# EAGLE design TiLDA Mk2 ProtoShield v0.1 (EAGLE 7.1.0)
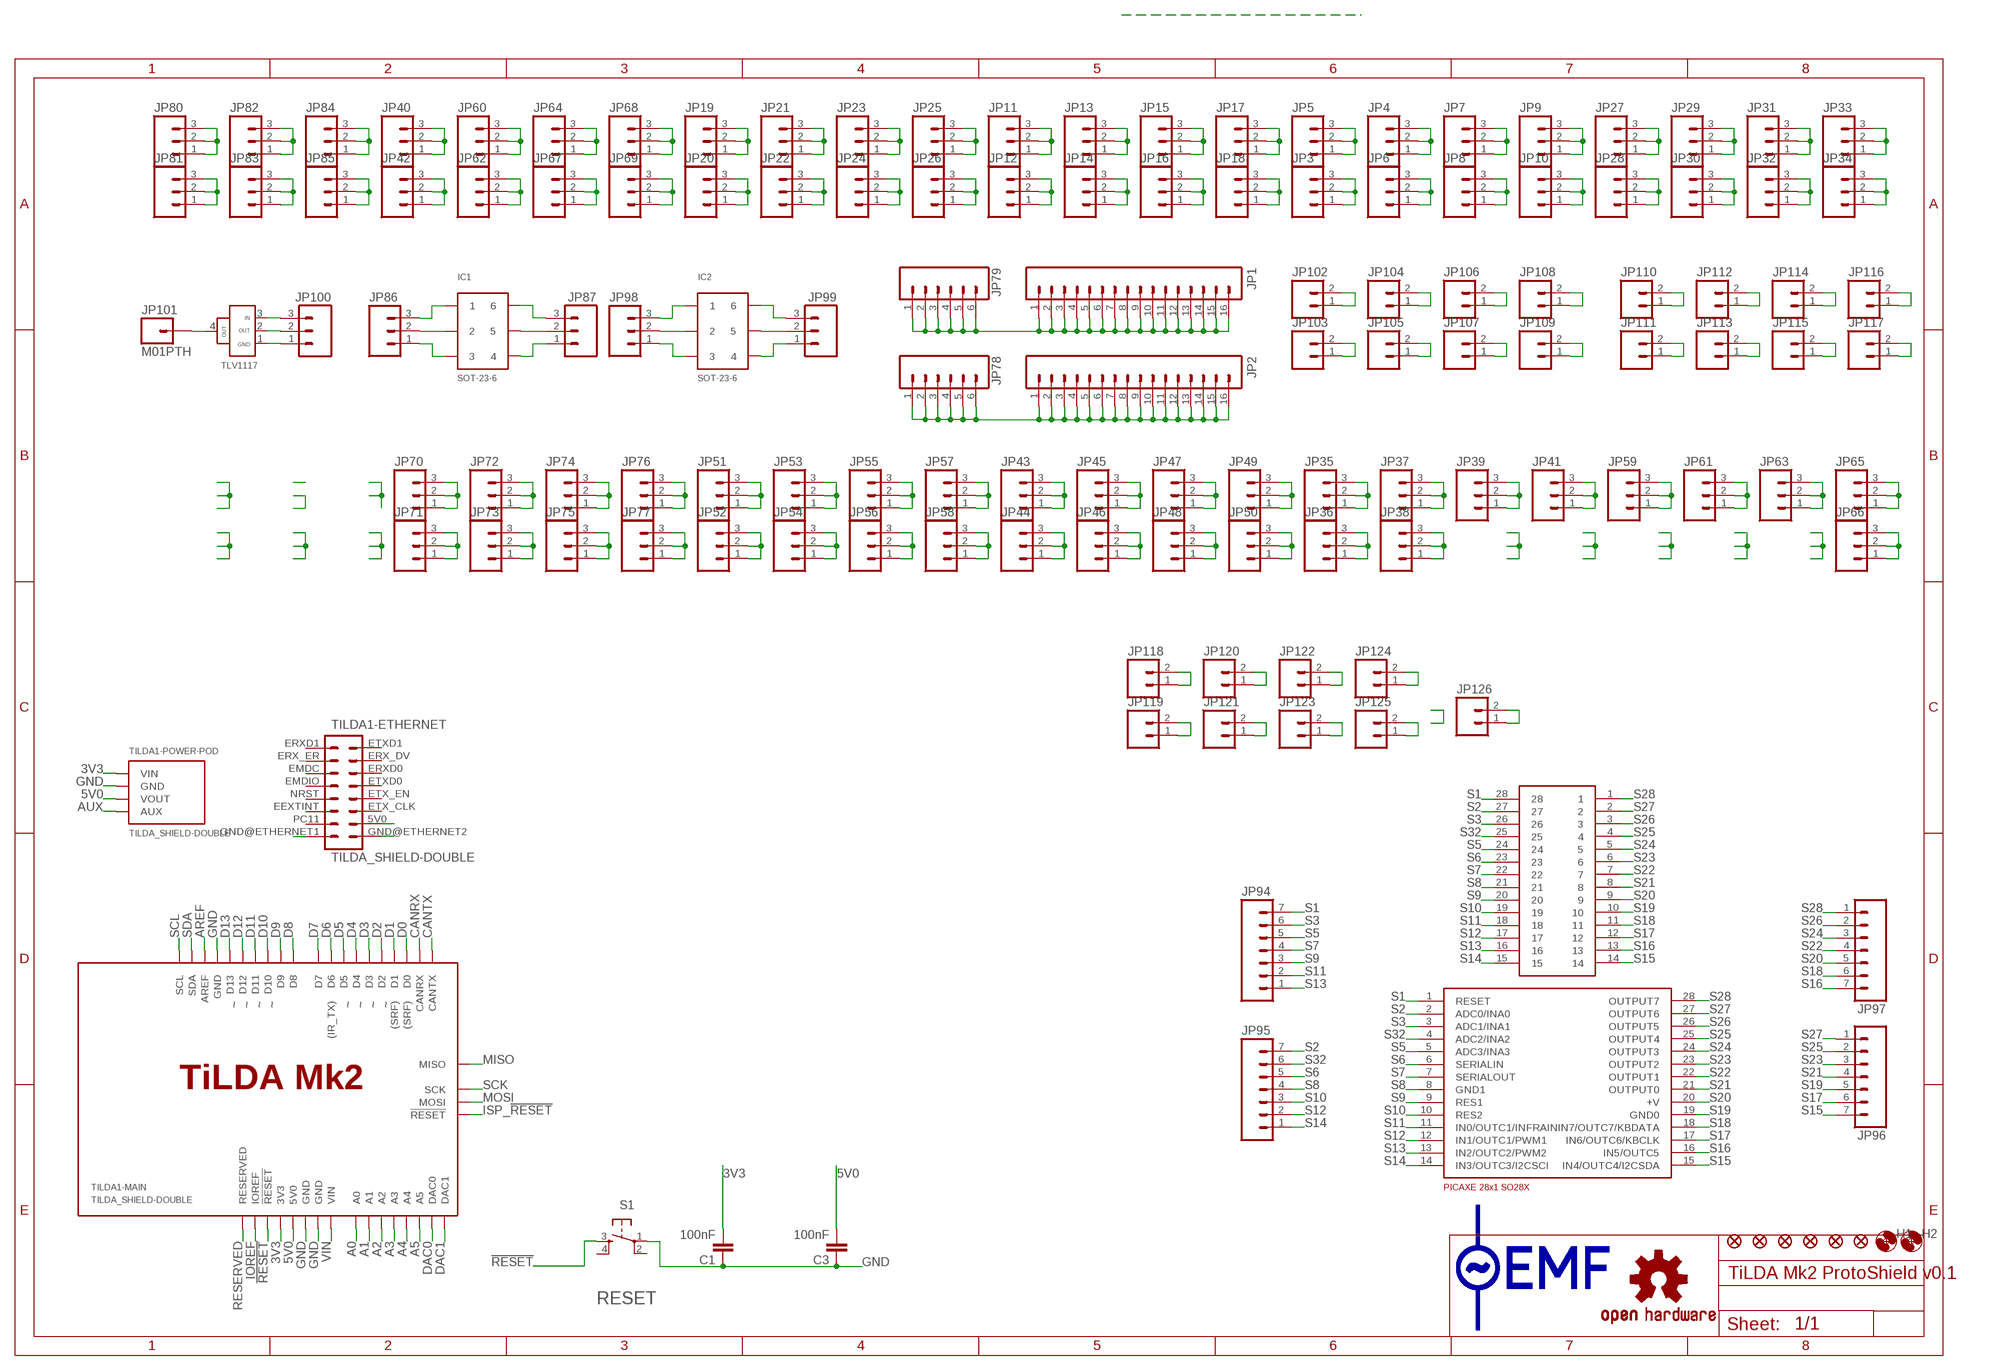
[diagram p0: schematic, sheet 1]

## Parts
C1  100nF  C-EU025-024X044  [C025-024X044]
C3  100nF  C-EU025-024X044  [C025-024X044]
FID1  FIDUCIAL1X2.5-STOP  [FIDUCIAL-1X2.5-STOP]
FID2  FIDUCIAL1X2.5-STOP  [FIDUCIAL-1X2.5-STOP]
FID3  FIDUCIAL1X2.5-STOP  [FIDUCIAL-1X2.5-STOP]
FID4  FIDUCIAL1X2.5-STOP  [FIDUCIAL-1X2.5-STOP]
FID5  FIDUCIAL1X2.5-STOP  [FIDUCIAL-1X2.5-STOP]
FID6  FIDUCIAL1X2.5-STOP  [FIDUCIAL-1X2.5-STOP]
H1  MOUNT-HOLE4.5-LWK  [4,5-LWK]
H2  MOUNT-HOLE4.5-LWK  [4,5-LWK]
IC1  SOT-23-6  [SOT-23-6]
IC2  SOT-23-6  [SOT-23-6]
JP1  M16PROTO_SILK  [1X16_PROTO_SILK]
JP2  M16PROTO_SILK  [1X16_PROTO_SILK]
JP3  M03PROTO_SILK  [1X03_PROTO_SILK]
JP4  M03PROTO_SILK  [1X03_PROTO_SILK]
JP5  M03PROTO_SILK  [1X03_PROTO_SILK]
JP6  M03PROTO_SILK  [1X03_PROTO_SILK]
JP7  M03PROTO_SILK  [1X03_PROTO_SILK]
JP8  M03PROTO_SILK  [1X03_PROTO_SILK]
JP9  M03PROTO_SILK  [1X03_PROTO_SILK]
JP10  M03PROTO_SILK  [1X03_PROTO_SILK]
JP11  M03PROTO_SILK  [1X03_PROTO_SILK]
JP12  M03PROTO_SILK  [1X03_PROTO_SILK]
JP13  M03PROTO_SILK  [1X03_PROTO_SILK]
JP14  M03PROTO_SILK  [1X03_PROTO_SILK]
JP15  M03PROTO_SILK  [1X03_PROTO_SILK]
JP16  M03PROTO_SILK  [1X03_PROTO_SILK]
JP17  M03PROTO_SILK  [1X03_PROTO_SILK]
JP18  M03PROTO_SILK  [1X03_PROTO_SILK]
JP19  M03PROTO_SILK  [1X03_PROTO_SILK]
JP20  M03PROTO_SILK  [1X03_PROTO_SILK]
JP21  M03PROTO_SILK  [1X03_PROTO_SILK]
JP22  M03PROTO_SILK  [1X03_PROTO_SILK]
JP23  M03PROTO_SILK  [1X03_PROTO_SILK]
JP24  M03PROTO_SILK  [1X03_PROTO_SILK]
JP25  M03PROTO_SILK  [1X03_PROTO_SILK]
JP26  M03PROTO_SILK  [1X03_PROTO_SILK]
JP27  M03PROTO_SILK  [1X03_PROTO_SILK]
JP28  M03PROTO_SILK  [1X03_PROTO_SILK]
JP29  M03PROTO_SILK  [1X03_PROTO_SILK]
JP30  M03PROTO_SILK  [1X03_PROTO_SILK]
JP31  M03PROTO_SILK  [1X03_PROTO_SILK]
JP32  M03PROTO_SILK  [1X03_PROTO_SILK]
JP33  M03PROTO_SILK  [1X03_PROTO_SILK]
JP34  M03PROTO_SILK  [1X03_PROTO_SILK]
JP35  M03PROTO_SILK  [1X03_PROTO_SILK]
JP36  M03PROTO_SILK  [1X03_PROTO_SILK]
JP37  M03PROTO_SILK  [1X03_PROTO_SILK]
JP38  M03PROTO_SILK  [1X03_PROTO_SILK]
JP39  M03PROTO_SILK  [1X03_PROTO_SILK]
JP40  M03PROTO_SILK  [1X03_PROTO_SILK]
JP41  M03PROTO_SILK  [1X03_PROTO_SILK]
JP42  M03PROTO_SILK  [1X03_PROTO_SILK]
JP43  M03PROTO_SILK  [1X03_PROTO_SILK]
JP44  M03PROTO_SILK  [1X03_PROTO_SILK]
JP45  M03PROTO_SILK  [1X03_PROTO_SILK]
JP46  M03PROTO_SILK  [1X03_PROTO_SILK]
JP47  M03PROTO_SILK  [1X03_PROTO_SILK]
JP48  M03PROTO_SILK  [1X03_PROTO_SILK]
JP49  M03PROTO_SILK  [1X03_PROTO_SILK]
JP50  M03PROTO_SILK  [1X03_PROTO_SILK]
JP51  M03PROTO_SILK  [1X03_PROTO_SILK]
JP52  M03PROTO_SILK  [1X03_PROTO_SILK]
JP53  M03PROTO_SILK  [1X03_PROTO_SILK]
JP54  M03PROTO_SILK  [1X03_PROTO_SILK]
JP55  M03PROTO_SILK  [1X03_PROTO_SILK]
JP56  M03PROTO_SILK  [1X03_PROTO_SILK]
JP57  M03PROTO_SILK  [1X03_PROTO_SILK]
JP58  M03PROTO_SILK  [1X03_PROTO_SILK]
JP59  M03PROTO_SILK  [1X03_PROTO_SILK]
JP60  M03PROTO_SILK  [1X03_PROTO_SILK]
JP61  M03PROTO_SILK  [1X03_PROTO_SILK]
JP62  M03PROTO_SILK  [1X03_PROTO_SILK]
JP63  M03PROTO_SILK  [1X03_PROTO_SILK]
JP64  M03PROTO_SILK  [1X03_PROTO_SILK]
JP65  M03PROTO_SILK  [1X03_PROTO_SILK]
JP66  M03PROTO_SILK  [1X03_PROTO_SILK]
JP67  M03PROTO_SILK  [1X03_PROTO_SILK]
JP68  M03PROTO_SILK  [1X03_PROTO_SILK]
JP69  M03PROTO_SILK  [1X03_PROTO_SILK]
JP70  M03PROTO_SILK  [1X03_PROTO_SILK]
JP71  M03PROTO_SILK  [1X03_PROTO_SILK]
JP72  M03PROTO_SILK  [1X03_PROTO_SILK]
JP73  M03PROTO_SILK  [1X03_PROTO_SILK]
JP74  M03PROTO_SILK  [1X03_PROTO_SILK]
JP75  M03PROTO_SILK  [1X03_PROTO_SILK]
JP76  M03PROTO_SILK  [1X03_PROTO_SILK]
JP77  M03PROTO_SILK  [1X03_PROTO_SILK]
JP78  M06PROTO_SILK  [1X06_PROTO_SLIK]
JP79  M06PROTO_SILK  [1X06_PROTO_SLIK]
JP80  M03PROTO_SILK  [1X03_PROTO_SILK]
JP81  M03PROTO_SILK  [1X03_PROTO_SILK]
JP82  M03PROTO_SILK  [1X03_PROTO_SILK]
JP83  M03PROTO_SILK  [1X03_PROTO_SILK]
JP84  M03PROTO_SILK  [1X03_PROTO_SILK]
JP85  M03PROTO_SILK  [1X03_PROTO_SILK]
JP86  M03PTH  [1X03]
JP87  M03PTH  [1X03]
JP94  M07  [1X07]
JP95  M07  [1X07]
JP96  M07  [1X07]
JP97  M07  [1X07]
JP98  M03PTH  [1X03]
JP99  M03PTH  [1X03]
JP100  M03PTH  [1X03]
JP101  M01PTH  [1X01]
JP102  M02PROTO_SILK  [1X02_PROTO_SILK]
JP103  M02PROTO_SILK  [1X02_PROTO_SILK]
JP104  M02PROTO_SILK  [1X02_PROTO_SILK]
JP105  M02PROTO_SILK  [1X02_PROTO_SILK]
JP106  M02PROTO_SILK  [1X02_PROTO_SILK]
JP107  M02PROTO_SILK  [1X02_PROTO_SILK]
JP108  M02PROTO_SILK  [1X02_PROTO_SILK]
JP109  M02PROTO_SILK  [1X02_PROTO_SILK]
JP110  M02PROTO_SILK  [1X02_PROTO_SILK]
JP111  M02PROTO_SILK  [1X02_PROTO_SILK]
JP112  M02PROTO_SILK  [1X02_PROTO_SILK]
JP113  M02PROTO_SILK  [1X02_PROTO_SILK]
JP114  M02PROTO_SILK  [1X02_PROTO_SILK]
JP115  M02PROTO_SILK  [1X02_PROTO_SILK]
JP116  M02PROTO_SILK  [1X02_PROTO_SILK]
JP117  M02PROTO_SILK  [1X02_PROTO_SILK]
JP118  M02PROTO_SILK  [1X02_PROTO_SILK]
JP119  M02PROTO_SILK  [1X02_PROTO_SILK]
JP120  M02PROTO_SILK  [1X02_PROTO_SILK]
JP121  M02PROTO_SILK  [1X02_PROTO_SILK]
JP122  M02PROTO_SILK  [1X02_PROTO_SILK]
JP123  M02PROTO_SILK  [1X02_PROTO_SILK]
JP124  M02PROTO_SILK  [1X02_PROTO_SILK]
JP125  M02PROTO_SILK  [1X02_PROTO_SILK]
JP126  M02PROTO_SILK  [1X02_PROTO_SILK]
LOGO1  OSHW-LOGOM  [OSHW-LOGO-M]
LOGO2  EMFLOGO-2014-BOTH  [EMFLOGO4]
S1  TAC_SWITCHPTH  [TACTILE-PTH]
TILDA1  TILDA_SHIELD-DOUBLE  [TILDA_SHIELD_DOUBLE]
U$1  TLV1117-33CDCY  [SOT223]
U$2  SSOP28-NOSLIK  [SSOP28D-NOSILK]
U$5  PICAXE-28X1-SO28-MULITWIDE  [S028-MUTLIWIDE]

## Nets
3V3: C1.2 TILDA1.3V3@1(-MAIN:3V3) TILDA1.3V3@2(-MAIN:3V3) TILDA1.3V3@POD1(-POWER-POD:VIN) TILDA1.3V3@POD(-POWER-POD:VIN)
5V0: C3.2 TILDA1.5V0 TILDA1.5V0@1(-MAIN:5V0) TILDA1.5V0@POD1(-POWER-POD:VOUT) TILDA1.5V0@POD(-POWER-POD:VOUT) TILDA1.5V(-MAIN:5V0) TILDA1.5V@ISP(-MAIN:5V0) TILDA1.5V@ISP@1(-MAIN:5V0)
!RESET: S1.3 TILDA1.!RESET(-MAIN:!RESET) TILDA1.!RESET@1(-MAIN:!RESET)
A0: TILDA1.A0(-MAIN:A0) TILDA1.A0@1(-MAIN:A0)
A1: TILDA1.A1(-MAIN:A1) TILDA1.A1@1(-MAIN:A1)
A2: TILDA1.A2(-MAIN:A2) TILDA1.A2@1(-MAIN:A2)
A3: TILDA1.A3(-MAIN:A3) TILDA1.A3@1(-MAIN:A3)
A4: TILDA1.A4(-MAIN:A4) TILDA1.A4@1(-MAIN:A4)
A5: TILDA1.A5(-MAIN:A5) TILDA1.A5@1(-MAIN:A5)
AREF: TILDA1.AREF(-MAIN:AREF) TILDA1.AREF@1(-MAIN:AREF)
AUX: TILDA1.AUX@POD1(-POWER-POD:AUX) TILDA1.AUX@POD(-POWER-POD:AUX)
CANRX: TILDA1.CANRX(-MAIN:CANRX) TILDA1.CANRX@1(-MAIN:CANRX)
CANTX: TILDA1.CANTX(-MAIN:CANTX) TILDA1.CANTX@1(-MAIN:CANTX)
D0: TILDA1.D0(-MAIN:D0) TILDA1.D0@1(-MAIN:D0)
D1: TILDA1.D1(-MAIN:D1) TILDA1.D1@1(-MAIN:D1)
D2: TILDA1.D2(-MAIN:D2) TILDA1.D2@1(-MAIN:D2)
D3: TILDA1.D3(-MAIN:D3) TILDA1.D3@1(-MAIN:D3)
D4: TILDA1.D4(-MAIN:D4) TILDA1.D4@1(-MAIN:D4)
D5: TILDA1.D5(-MAIN:D5) TILDA1.D5@1(-MAIN:D5)
D6: TILDA1.D6(-MAIN:D6) TILDA1.D6@1(-MAIN:D6)
D7: TILDA1.D7(-MAIN:D7) TILDA1.D7@1(-MAIN:D7)
D8: TILDA1.D8(-MAIN:D8) TILDA1.D8@1(-MAIN:D8)
D9: TILDA1.D9(-MAIN:D9) TILDA1.D9@1(-MAIN:D9)
D10: TILDA1.D10(-MAIN:D10) TILDA1.D10@1(-MAIN:D10)
D11: TILDA1.D11(-MAIN:D11) TILDA1.D11@1(-MAIN:D11)
D12: TILDA1.D12(-MAIN:D12) TILDA1.D12@1(-MAIN:D12)
D13: TILDA1.D13(-MAIN:D13) TILDA1.D13@1(-MAIN:D13)
DAC0: TILDA1.DAC0(-MAIN:DAC0) TILDA1.DAC0@1(-MAIN:DAC0)
DAC1: TILDA1.DAC1(-MAIN:DAC1) TILDA1.DAC1@1(-MAIN:DAC1)
GND: C1.1 C3.1 S1.1 TILDA1.GND@1(-MAIN:GND) TILDA1.GND@2(-MAIN:GND) TILDA1.GND@3(-MAIN:GND) TILDA1.GND@4(-MAIN:GND) TILDA1.GND@5(-MAIN:GND) TILDA1.GND@6(-MAIN:GND) TILDA1.GND@ETHERNET1 TILDA1.GND@ETHERNET2 TILDA1.GND@ISP1(-MAIN:GND) TILDA1.GND@ISP(-MAIN:GND) TILDA1.GND@POD1(-POWER-POD:GND) TILDA1.GND@POD(-POWER-POD:GND)
IOREF: TILDA1.IOREF(-MAIN:IOREF) TILDA1.IOREF@1(-MAIN:IOREF)
ISP_!RESET: TILDA1.!RESET@ISP1(-MAIN:!RESET) TILDA1.!RESET@ISP(-MAIN:!RESET)
MISO: TILDA1.MISO(-MAIN:MISO) TILDA1.MISO@1(-MAIN:MISO)
MOSI: TILDA1.MOSI(-MAIN:MOSI) TILDA1.MOSI@1(-MAIN:MOSI)
N$1: JP1.1 JP1.2 JP1.3 JP1.4 JP1.5 JP1.6 JP1.7 JP1.8 JP1.9 JP1.10 JP1.11 JP1.12 JP1.13 JP1.14 JP1.15 JP1.16 JP79.1 JP79.2 JP79.3 JP79.4 JP79.5 JP79.6
N$2: JP2.1 JP2.2 JP2.3 JP2.4 JP2.5 JP2.6 JP2.7 JP2.8 JP2.9 JP2.10 JP2.11 JP2.12 JP2.13 JP2.14 JP2.15 JP2.16 JP78.1 JP78.2 JP78.3 JP78.4 JP78.5 JP78.6
N$3: JP5.1 JP5.2 JP5.3
N$4: JP3.1 JP3.2 JP3.3
N$5: JP4.1 JP4.2 JP4.3
N$6: JP6.1 JP6.2 JP6.3
N$7: JP7.1 JP7.2 JP7.3
N$8: JP8.1 JP8.2 JP8.3
N$9: JP9.1 JP9.2 JP9.3
N$10: JP10.1 JP10.2 JP10.3
N$11: JP11.1 JP11.2 JP11.3
N$12: JP12.1 JP12.2 JP12.3
N$13: JP13.1 JP13.2 JP13.3
N$14: JP14.1 JP14.2 JP14.3
N$15: JP15.1 JP15.2 JP15.3
N$16: JP16.1 JP16.2 JP16.3
N$17: JP17.1 JP17.2 JP17.3
N$18: JP18.1 JP18.2 JP18.3
N$19: JP19.1 JP19.2 JP19.3
N$20: JP20.1 JP20.2 JP20.3
N$21: JP21.1 JP21.2 JP21.3
N$22: JP22.1 JP22.2 JP22.3
N$23: JP23.1 JP23.2 JP23.3
N$24: JP24.1 JP24.2 JP24.3
N$25: JP25.1 JP25.2 JP25.3
N$26: JP26.1 JP26.2 JP26.3
N$27: JP27.1 JP27.2 JP27.3
N$28: JP28.1 JP28.2 JP28.3
N$29: JP29.1 JP29.2 JP29.3
N$30: JP30.1 JP30.2 JP30.3
N$31: JP31.1 JP31.2 JP31.3
N$32: JP32.1 JP32.2 JP32.3
N$33: JP33.1 JP33.2 JP33.3
N$34: JP34.1 JP34.2 JP34.3
N$35: JP35.1 JP35.2 JP35.3
N$36: JP36.1 JP36.2 JP36.3
N$37: JP37.1 JP37.2 JP37.3
N$38: JP38.1 JP38.2 JP38.3
N$39: JP39.1 JP39.2 JP39.3
N$41: JP41.1 JP41.2 JP41.3
N$43: JP43.1 JP43.2 JP43.3
N$44: JP44.1 JP44.2 JP44.3
N$45: JP45.1 JP45.2 JP45.3
N$46: JP46.1 JP46.2 JP46.3
N$47: JP47.1 JP47.2 JP47.3
N$48: JP48.1 JP48.2 JP48.3
N$49: JP49.1 JP49.2 JP49.3
N$50: JP50.1 JP50.2 JP50.3
N$51: JP51.1 JP51.2 JP51.3
N$52: JP52.1 JP52.2 JP52.3
N$53: JP53.1 JP53.2 JP53.3
N$54: JP54.1 JP54.2 JP54.3
N$55: JP55.1 JP55.2 JP55.3
N$56: JP56.1 JP56.2 JP56.3
N$57: JP57.1 JP57.2 JP57.3
N$58: JP58.1 JP58.2 JP58.3
N$59: JP59.1 JP59.2 JP59.3
N$61: JP61.1 JP61.2 JP61.3
N$63: JP63.1 JP63.2 JP63.3
N$65: JP65.1 JP65.2 JP65.3
N$66: JP66.1 JP66.2 JP66.3
N$67: JP40.1 JP40.2 JP40.3
N$68: JP42.1 JP42.2 JP42.3
N$69: JP60.1 JP60.2 JP60.3
N$70: JP62.1 JP62.2 JP62.3
N$71: JP64.1 JP64.2 JP64.3
N$72: JP67.1 JP67.2 JP67.3
N$73: JP68.1 JP68.2 JP68.3
N$74: JP69.1 JP69.2 JP69.3
N$75: JP70.1 JP70.2 JP70.3
N$76: JP71.1 JP71.2 JP71.3
N$77: JP72.1 JP72.2 JP72.3
N$78: JP73.1 JP73.2 JP73.3
N$79: JP74.1 JP74.2 JP74.3
N$80: JP75.1 JP75.2 JP75.3
N$81: JP76.1 JP76.2 JP76.3
N$82: JP77.1 JP77.2 JP77.3
N$83: IC1.2 JP86.2
N$84: IC1.1 JP86.3
N$85: JP80.1 JP80.2 JP80.3
N$86: JP81.1 JP81.2 JP81.3
N$87: JP82.1 JP82.2 JP82.3
N$88: JP83.1 JP83.2 JP83.3
N$89: JP84.1 JP84.2 JP84.3
N$90: JP85.1 JP85.2 JP85.3
N$91: IC1.3 JP86.1
N$92: IC1.5 JP87.2
N$99: IC1.6 JP87.3
N$100: IC1.4 JP87.1
N$101: IC2.2 JP98.2
N$102: IC2.1 JP98.3
N$103: IC2.3 JP98.1
N$104: IC2.5 JP99.2
N$105: IC2.6 JP99.3
N$106: IC2.4 JP99.1
N$107: JP100.1 U$1.1(GND)
N$108: JP100.2 U$1.2(OUT1)
N$109: JP100.3 U$1.3(IN)
N$110: JP101.1 U$1.4(OUT2)
N$111: JP102.1 JP102.2
N$112: JP103.1 JP103.2
N$113: JP104.1 JP104.2
N$114: JP105.1 JP105.2
N$115: JP106.1 JP106.2
N$116: JP107.1 JP107.2
N$117: JP108.1 JP108.2
N$118: JP109.1 JP109.2
N$119: JP110.1 JP110.2
N$120: JP111.1 JP111.2
N$121: JP112.1 JP112.2
N$122: JP113.1 JP113.2
N$123: JP114.1 JP114.2
N$124: JP115.1 JP115.2
N$125: JP116.1 JP116.2
N$126: JP117.1 JP117.2
N$127: JP118.1 JP118.2
N$128: JP119.1 JP119.2
N$129: JP120.1 JP120.2
N$130: JP121.1 JP121.2
N$131: JP122.1 JP122.2
N$132: JP123.1 JP123.2
N$133: JP124.1 JP124.2
N$134: JP125.1 JP125.2
N$136: JP126.1 JP126.2
RESERVED: TILDA1.RESERVED(-MAIN:RESERVED) TILDA1.RESERVED@1(-MAIN:RESERVED)
S1: JP94.7 U$2.28 U$5.1(RESET)
S2: JP95.7 U$2.27 U$5.2(ADC0/INA0)
S3: JP94.6 U$2.26 U$5.3(ADC1/INA1)
S5: JP94.5 U$2.24 U$5.5(ADC3/INA3)
S6: JP95.5 U$2.23 U$5.6(SERIALIN)
S7: JP94.4 U$2.22 U$5.7(SERIALOUT)
S8: JP95.4 U$2.21 U$5.8(GND1)
S9: JP94.3 U$2.20 U$5.9(RES1)
S10: JP95.3 U$2.19 U$5.10(RES2)
S11: JP94.2 U$2.18 U$5.11(IN0/OUTC1/INFRAIN)
S12: JP95.2 U$2.17 U$5.12(IN1/OUTC1/PWM1)
S13: JP94.1 U$2.16 U$5.13(IN2/OUTC2/PWM2)
S14: JP95.1 U$2.15 U$5.14(IN3/OUTC3/I2CSCI)
S15: JP96.7 U$2.14 U$5.15(IN4/OUTC4/I2CSDA)
S16: JP97.7 U$2.13 U$5.16(IN5/OUTC5)
S17: JP96.6 U$2.12 U$5.17(IN6/OUTC6/KBCLK)
S18: JP97.6 U$2.11 U$5.18(IN7/OUTC7/KBDATA)
S19: JP96.5 U$2.10 U$5.19(GND0)
S20: JP97.5 U$2.9 U$5.20(+V)
S21: JP96.4 U$2.8 U$5.21(OUTPUT0)
S22: JP97.4 U$2.7 U$5.22(OUTPUT1)
S23: JP96.3 U$2.6 U$5.23(OUTPUT2)
S24: JP97.3 U$2.5 U$5.24(OUTPUT3)
S25: JP96.2 U$2.4 U$5.25(OUTPUT4)
S26: JP97.2 U$2.3 U$5.26(OUTPUT5)
S27: JP96.1 U$2.2 U$5.27(OUTPUT6)
S28: JP97.1 U$2.1 U$5.28(OUTPUT7)
S32: JP95.6 U$2.25 U$5.4(ADC2/INA2)
SCK: TILDA1.SCK(-MAIN:SCK) TILDA1.SCK@1(-MAIN:SCK)
SCL: TILDA1.SCL(-MAIN:SCL) TILDA1.SCL@1(-MAIN:SCL)
SDA: TILDA1.SDA(-MAIN:SDA) TILDA1.SDA@1(-MAIN:SDA)
VIN: TILDA1.VIN(-MAIN:VIN) TILDA1.VIN@1(-MAIN:VIN)
Unconnected: S1.2 S1.4 TILDA1.EEXTINT TILDA1.EMDC TILDA1.EMDIO TILDA1.ERX_DV TILDA1.ERX_ER TILDA1.ERXD0 TILDA1.ERXD1 TILDA1.ETX_CLK TILDA1.ETX_EN TILDA1.ETXD0 TILDA1.ETXD1 TILDA1.NRST TILDA1.PC11

## Notes on the sheet
- RESET

## Library data of the parts
C1 C3 = rcl:C-EU: CAPACITOR, European symbol
FID1-FID6 = TiLDA Mk2 Parts:FIDUCIAL: Fiducial Alignment Points Various fiducial points for machine vision alignment.
H1 H2 = TiLDA Mk2 Parts:MOUNT-HOLE: MOUNTING HOLE with drill center marker
IC1 IC2 = TiLDA Mk2 Parts:SOT-23-6
JP1 JP2 = TiLDA Mk2 Parts:M16
JP3-JP77 JP80-JP87 JP98-JP100 = TiLDA Mk2 Parts:M03: Header 3 Standard 3-pin 0.1" header. Use with straight break away headers (SKU : PRT-00116), right angle break away headers (PRT-00553), swiss pins (PRT-00743), machine pins (PRT-00117), and female headers (PRT-00115). Molex polarized connector foot print use with SKU : PRT-08232 with associated crimp pins and housings.
JP78 JP79 = TiLDA Mk2 Parts:M06: Header 6 Standard 6-pin 0.1" header. Use with straight break away headers (SKU : PRT-00116), right angle break away headers (PRT-00553), swiss pins (PRT-00743), machine pins (PRT-00117), and female headers (PRT-00115). Molex polarized connector foot print use with SKU : PRT-08094 with associated crimp pins and housings. NOTES ON THE VARIANTS LOCK and LOCK_LONGPADS... This footprint was designed to help hold the alignment of a through-hole component (i.e. 6-pin header) while soldering it into place. You may notice that each hole has been shifted either up or down by 0.005 of an inch from it's more standard position (which is a perfectly straight line). This slight alteration caused the pins (the squares in the middle) to touch the edges of the holes. Because they are alternating, it causes a "brace" to hold the component in place. 0.005 has proven to be the perfect amount of "off-center" position when using our standard breakaway headers. Although looks a little odd when you look at the bare footprint, once you have a header in there, the alteration is very hard to notice. Also, if you push a header all the way into place, it is covered up entirely on the bottom side. This idea of altering the position of holes to aid alignment will be further integrated into the Sparkfun Library for other footprints. It can help hold any component with 3 or more connection pins.
JP94-JP97 = TiLDA Mk2 Parts:M07: Header 7 Standard 7-pin 0.1" header. Use with straight break away headers (SKU : PRT-00116), right angle break away headers (PRT-00553), swiss pins (PRT-00743), machine pins (PRT-00117), and female headers (PRT-00115). NOTES ON THE VARIANTS LOCK and LOCK_LONGPADS... This footprint was designed to help hold the alignment of a through-hole component (i.e. 7-pin header) while soldering it into place. You may notice that each hole has been shifted either up or down by 0.005 of an inch from it's more standard position (which is usually a perfectly straight line). This slight alteration caused the pins (the squares in the middle) to touch the edges of the holes. Because they are alternating, it causes a "brace" to hold the header in place. 0.005 has proven to be the perfect amount of "off-center" position when using our standard breakaway headers. Although looks a little odd when you look at the bare footprint, once you have a header in there, the alteration is very hard to notice. Also, if you push a header all the way into place, it is covered up entirely on the bottom side. This idea of altering the position of holes to aid alignment will be further integrated into the Sparkfun Library for other footprints. It can help hold any component with 3 or more connection pins.
JP101 = TiLDA Mk2 Parts:M01: Header 1 Standard 1-pin 0.1" header. Use with straight break away headers (SKU : PRT-00116), right angle break away headers (PRT-00553), swiss pins (PRT-00743), machine pins (PRT-00117), and female headers (PRT-00115).
JP102-JP126 = TiLDA Mk2 Parts:M02: Header 2 Standard 2-pin 0.1" header. Use with straight break away headers (SKU : PRT-00116), right angle break away headers (PRT-00553), swiss pins (PRT-00743), machine pins (PRT-00117), and female headers (PRT-00115). Molex polarized connector foot print use with SKU : PRT-08233 with associated crimp pins and housings.
LOGO1 = TiLDA Mk2 Parts:OSHW-LOGO: Open Source Hardware Logo This logo indicates the piece of hardware it is found on incorporates a OSHW license and/or adheres to the definition of open source hardware found here: http://freedomdefined.org/OSHW
LOGO2 = TiLDA Mk2 Parts:EMFLOGO
S1 = CISECO eaglecad designs:TAC_SWITCH: Momentary Switch Button commonly used for reset or general input. Spark Fun Electronics SKU : COM-00097
TILDA1 = TiLDA Mk2 Parts:TILDA_SHIELD
U$1 = TiLDA Mk2 Parts:TLV1117-33CDCY
U$2 = CISECO eaglecad designs:SSOP28
U$5 = CISECO eaglecad designs:PICAXE-28X1-SO28

## Net classes
0 default: width 0.15 mm, drill 0.3 mm, clearance 0.15 mm
1 USB: width 0.254 mm, drill 0.4 mm, clearance 0.2 mm to class 0, clearance 0.4 mm
2 GND: width 0.3 mm, drill 0.4 mm, clearance 0.2 mm to class 0, clearance 0.2 mm
3 USBVCC: width 0.6 mm, drill 0.5 mm, clearance 0.2 mm to class 0, clearance 0.2 mm
4 ANT: width 1.27 mm, drill 0.5 mm, clearance 0.35 mm to class 0, clearance 0.35 mm to class 1, clearance 0.35 mm to class 2, clearance 0.35 mm to class 3, clearance 0.35 mm
5 CAP: width 0.15 mm, drill 0.5 mm, clearance 0.8 mm to class 0, clearance 0.8 mm to class 1, clearance 0.8 mm to class 2, clearance 0.8 mm to class 3, clearance 0.8 mm to class 4, clearance 0.8 mm

## Board
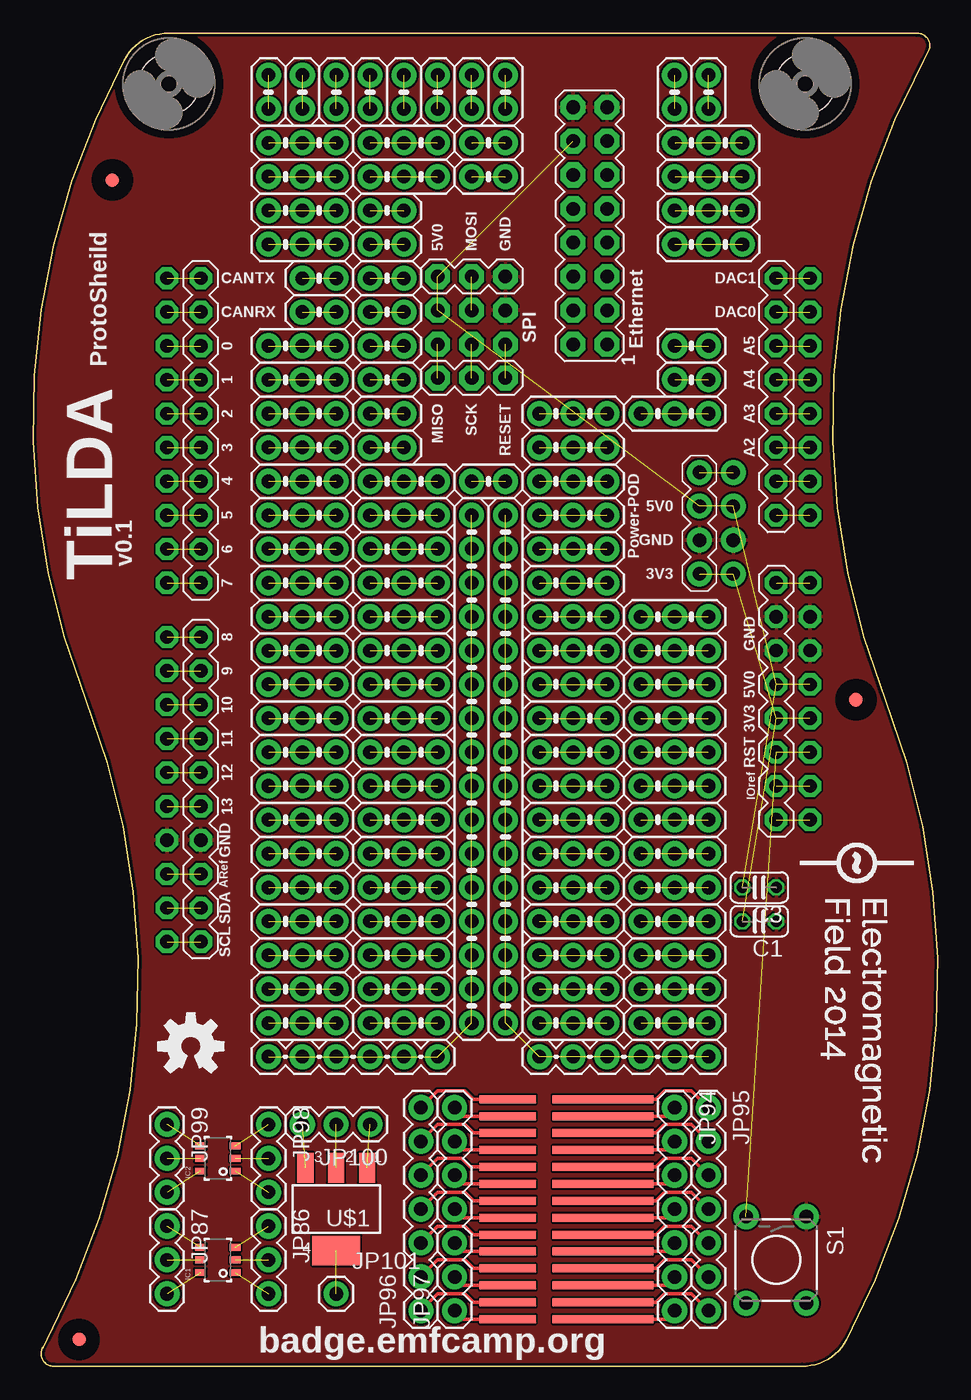
[diagram p1: board, top side]
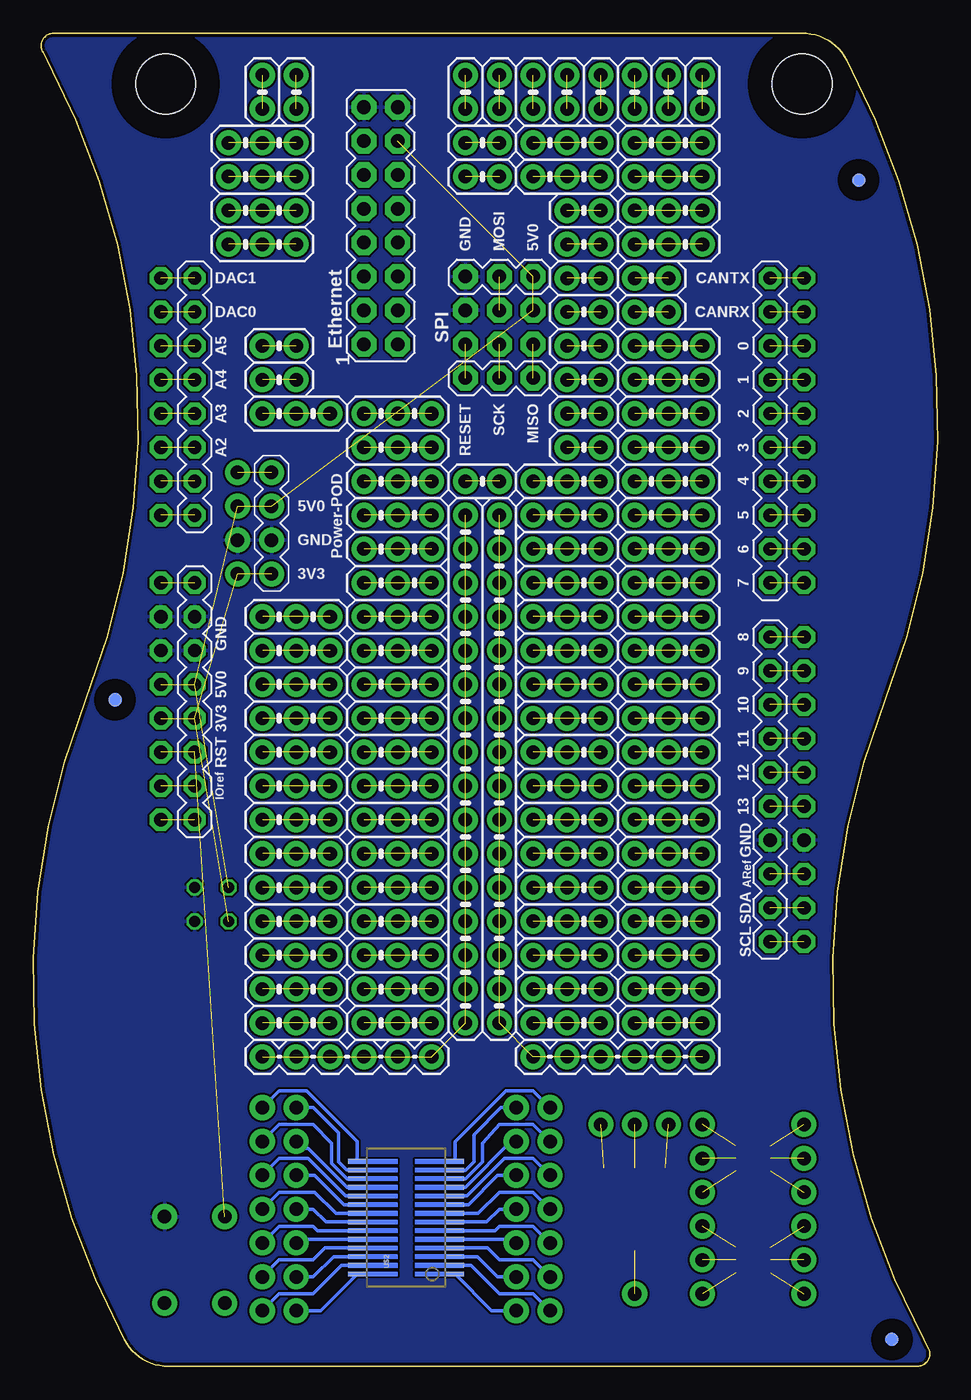
[diagram p2: board, bottom side, seen from below]

Size 67.86 x 100 mm. Coordinates in mm from the lower left corner, seen from the top.
Copper layers (1*2*15*16): Top 0.035mm / dielectric 0.2mm / Route2 0.035mm / dielectric 1mm / Route15 0.035mm / dielectric 0.2mm / Bottom 0.035mm
Design rules "default": minimum track width 0.15mm, minimum drill 0.3mm, track to track 0.15mm, track to pad 0.15mm, pad to pad 0.15mm, via to via 0.15mm, smd to smd 0.15mm, copper to edge 0.2mm, drill to drill 12mil, minimum pad ring 8mil, minimum via ring 8mil, stop-mask expansion 2mil, vias tented up to drill 25mil, thermal gap 0.15mm

### Footprints (pad centres in the part's own frame; a part is rotated, then mirrored left to right if it is on the bottom)
C025-024X044 = drill 0.813 octagon: 1 -1.27,0; 2 1.27,0
FIDUCIAL-1X2.5-STOP = smd 1 x 1: 1 0,0
4,5-LWK = hole 4.5: 0,0
SOT-23-6 = smd 0.51 x 0.8: 1 -0.95,-1.3; 2 0,-1.3; 3 0.95,-1.3; 4 0.95,1.3; 5 0,1.3; 6 -0.95,1.3
1X16_PROTO_SILK = drill 1.016 pad 1.88: 1 0,0; 2 2.54,0; 3 5.08,0; 4 7.62,0; 5 10.16,0; 6 12.7,0; 7 15.24,0; 8 17.78,0; 9 20.32,0; 10 22.86,0; 11 25.4,0; 12 27.94,0; 13 30.48,0; 14 33.02,0; 15 35.56,0; 16 38.1,0
1X03_PROTO_SILK = drill 1.016 pad 1.88: 1 0,0; 2 2.54,0; 3 5.08,0
1X06_PROTO_SLIK = drill 1.016 pad 1.88: 1 0,0; 2 2.54,0; 3 5.08,0; 4 7.62,0; 5 10.16,0; 6 12.7,0
1X03 = drill 1.016 pad 1.88: 1 0,0; 2 2.54,0; 3 5.08,0
1X07 = drill 1.016 pad 1.88: 1 0,0; 2 2.54,0; 3 5.08,0; 4 7.62,0; 5 10.16,0; 6 12.7,0; 7 15.24,0
1X01 = drill 1.016 pad 1.88: 1 0,0
1X02_PROTO_SILK = drill 1.016 pad 1.88: 1 0,0; 2 2.54,0
TACTILE-PTH = drill 1.016 pad 1.88: 1 -3.251,2.261; 2 3.251,2.261; 3 -3.251,-2.261; 4 3.251,-2.261
TILDA_SHIELD_DOUBLE = drill 1 pad 1.676 octagon: 3V3@1 48.61,9.64; 3V3@2 48.61,12.18; 5V 51.15,9.64; 5V0@1 51.15,12.18; !RESET 46.07,9.64; !RESET@1 46.07,12.18; A0 63.85,9.64; A0@1 63.85,12.18; A1 66.39,9.64; A1@1 66.39,12.18; A2 68.93,9.64; A2@1 68.93,12.18; A3 71.47,9.64; A3@1 71.47,12.18; A4 74.01,9.64; A4@1 74.01,12.18; A5 76.55,9.64; A5@1 76.55,12.18; AREF 36.926,57.9; AREF@1 36.926,55.36; CANRX 79.09,57.9; CANRX@1 79.09,55.36; CANTX 81.63,57.9; CANTX@1 81.63,55.36; D0 76.55,57.9; D0@1 76.55,55.36; D1 74.01,57.9; D1@1 74.01,55.36; D2 71.47,57.9; D2@1 71.47,55.36; D3 68.93,57.9; D3@1 68.93,55.36; D4 66.39,57.9; D4@1 66.39,55.36; D5 63.85,57.9; D5@1 63.85,55.36; D6 61.31,57.9; D6@1 61.31,55.36; D7 58.77,57.9; D7@1 58.77,55.36; D8 54.706,57.9; D8@1 54.706,55.36; D9 52.166,57.9; D9@1 52.166,55.36; D10 49.626,57.9; D10@1 49.626,55.36; D11 47.086,57.9; D11@1 47.086,55.36; D12 44.546,57.9; D12@1 44.546,55.36; D13 42.006,57.9; D13@1 42.006,55.36; DAC0 79.09,9.64; DAC0@1 79.09,12.18; DAC1 81.63,9.64; DAC1@1 81.63,12.18; GND@1 56.23,9.64; GND@2 53.69,9.64; GND@3 39.466,57.9; GND@4 56.23,12.18; GND@5 53.69,12.18; GND@6 39.466,55.36; IOREF 43.53,9.64; IOREF@1 43.53,12.18; RESERVED 40.99,9.64; RESERVED@1 40.99,12.18; SCL 31.846,57.9; SCL@1 31.846,55.36; SDA 34.386,57.9; SDA@1 34.386,55.36; VIN 58.77,9.64; VIN@1 58.77,12.18 | drill 1.016 pad 1.88: 3V3@POD 59.44,15.4; 3V3@POD1 59.44,17.94; 5V0@POD 64.52,15.4; 5V0@POD1 64.52,17.94; AUX@POD 67.06,15.4; AUX@POD1 67.06,17.94; GND@POD 61.98,15.4; GND@POD1 61.98,17.94 | drill 1.016 pad 1.88 octagon: 5V0 91.917,27.42; 5V@ISP 79.217,37.58; 5V@ISP@1 81.757,37.58; !RESET@ISP 76.677,32.5; !RESET@ISP1 74.137,32.5; EEXTINT 89.377,24.88; EMDC 81.757,24.88; EMDIO 84.297,24.88; ERX_DV 79.217,27.42; ERX_ER 79.217,24.88; ERXD0 81.757,27.42; ERXD1 76.677,24.88; ETX_CLK 89.377,27.42; ETX_EN 86.837,27.42; ETXD0 84.297,27.42; ETXD1 76.677,27.42; GND@ETHERNET1 94.457,24.88; GND@ETHERNET2 94.457,27.42; GND@ISP 79.217,32.5; GND@ISP1 81.757,32.5; MISO 76.677,37.58; MISO@1 74.137,37.58; MOSI 79.217,35.04; MOSI@1 81.757,35.04; NRST 86.837,24.88; PC11 91.917,24.88; SCK 76.677,35.04; SCK@1 74.137,35.04
SOT223 = smd 1.219 x 2.235: 1 -2.311,-3.099; 2 0,-3.099; 3 2.311,-3.099 | smd 3.6 x 2.2: 4 0,3.099
SSOP28D-NOSILK = smd 0.348 x 1.397: 1 -4.225,-3.656; 2 -3.575,-3.656; 3 -2.925,-3.656; 4 -2.275,-3.656; 5 -1.625,-3.656; 6 -0.975,-3.656; 7 -0.325,-3.656; 8 0.325,-3.656; 9 0.975,-3.656; 10 1.625,-3.656; 11 2.275,-3.656; 12 2.925,-3.656; 13 3.575,-3.656; 14 4.225,-3.656; 15 4.225,3.656; 16 3.575,3.656; 17 2.925,3.656; 18 2.275,3.656; 19 1.625,3.656; 20 0.975,3.656; 21 0.325,3.656; 22 -0.325,3.656; 23 -0.975,3.656; 24 -1.625,3.656; 25 -2.275,3.656; 26 -2.925,3.656; 27 -3.575,3.656; 28 -4.225,3.656
S028-MUTLIWIDE = smd 0.6 x 7.55: 1 -7.62,-4.4; 2 -6.35,-4.4; 3 -5.08,-4.4; 4 -3.81,-4.4; 5 -2.54,-4.4; 6 -1.27,-4.4; 7 0,-4.4; 8 1.27,-4.4; 9 2.54,-4.4; 10 3.81,-4.4; 11 5.08,-4.4; 12 6.35,-4.4; 13 7.62,-4.4; 14 8.89,-4.4 | smd 0.6 x 4.22: 15 8.89,2.735; 16 7.62,2.735; 17 6.35,2.735; 18 5.08,2.735; 19 3.81,2.735; 20 2.54,2.735; 21 1.27,2.735; 22 0,2.735; 23 -1.27,2.735; 24 -2.54,2.735; 25 -3.81,2.735; 26 -5.08,2.735; 27 -6.35,2.735; 28 -7.62,2.735

### Placement (x,y rotation side)
C1  54.48,33.37 180 top
C3  54.48,35.91 180 top
FID1  3.43,2 0 top
FID2  61.73,50 0 top
FID3  5.93,89 0 top
FID4  3.43,2 0 bottom
FID5  61.73,50 0 bottom
FID6  5.93,89 0 bottom
H1  10.18,96.2 0 top
H2  57.93,96.2 0 top
IC1  13.84,7.97 90 top
IC2  13.84,15.59 90 top
JP1  32.89,63.85 270 top
JP2  35.43,63.85 270 top
JP3  25.27,63.85 0 top
JP4  25.27,61.31 0 top
JP5  17.65,71.47 0 top
JP6  25.27,58.77 0 top
JP7  25.27,56.23 0 top
JP8  25.27,53.69 0 top
JP9  25.27,51.15 0 top
JP10  25.27,48.61 0 top
JP11  25.27,46.07 0 top
JP12  17.65,48.61 0 top
JP13  25.27,43.53 0 top
JP14  17.65,46.07 0 top
JP15  25.27,40.99 0 top
JP16  17.65,43.53 0 top
JP17  25.27,38.45 0 top
JP18  17.65,40.99 0 top
JP19  17.65,68.93 0 top
JP20  17.65,38.45 0 top
JP21  17.65,66.39 0 top
JP22  25.27,35.91 0 top
JP23  17.65,63.85 0 top
JP24  17.65,35.91 0 top
JP25  17.65,61.31 0 top
JP26  17.65,33.37 0 top
JP27  17.65,58.77 0 top
JP28  25.27,33.37 0 top
JP29  17.65,56.23 0 top
JP30  17.65,76.55 0 top
JP31  17.65,53.69 0 top
JP32  17.65,74.01 0 top
JP33  17.65,51.15 0 top
JP34  25.27,66.39 0 top
JP35  37.97,71.47 0 top
JP36  45.59,71.47 0 top
JP37  45.59,43.53 0 top
JP38  37.97,68.93 0 top
JP39  45.59,33.37 0 top
JP40  17.65,30.83 0 top
JP41  37.97,63.85 0 top
JP42  25.27,30.83 0 top
JP43  37.97,66.39 0 top
JP44  37.97,58.77 0 top
JP45  45.59,56.23 0 top
JP46  37.97,61.31 0 top
JP47  37.97,53.69 0 top
JP48  45.59,53.69 0 top
JP49  37.97,56.23 0 top
JP50  37.97,48.61 0 top
JP51  45.59,48.61 0 top
JP52  37.97,51.15 0 top
JP53  37.97,43.53 0 top
JP54  45.59,35.91 0 top
JP55  37.97,46.07 0 top
JP56  37.97,38.45 0 top
JP57  45.59,40.99 0 top
JP58  37.97,40.99 0 top
JP59  37.97,33.37 0 top
JP60  17.65,25.75 0 top
JP61  37.97,35.91 0 top
JP62  25.27,25.75 0 top
JP63  45.59,51.15 0 top
JP64  17.65,91.79 0 top
JP65  45.59,38.45 0 top
JP66  45.59,46.07 0 top
JP67  25.27,91.79 0 top
JP68  17.65,86.71 0 top
JP69  48.13,86.71 0 top
JP70  17.65,28.29 0 top
JP71  25.27,28.29 0 top
JP72  37.97,25.75 0 top
JP73  45.59,25.75 0 top
JP74  17.65,89.25 0 top
JP75  25.27,89.25 0 top
JP76  17.65,84.17 0 top
JP77  48.13,84.17 0 top
JP78  37.97,23.21 0 top
JP79  17.65,23.21 0 top
JP80  37.97,30.83 0 top
JP81  45.59,30.83 0 top
JP82  37.97,28.29 0 top
JP83  45.59,28.29 0 top
JP84  48.13,89.25 0 top
JP85  48.13,91.79 0 top
JP86  17.65,10.51 270 top
JP87  10.03,10.51 270 top
JP94  48.13,19.4 270 top
JP95  50.67,19.4 270 top
JP96  29.08,4.16 90 top
JP97  31.62,4.16 90 top
JP98  17.65,18.13 270 top
JP99  10.03,18.13 270 top
JP100  25.27,18.13 180 top
JP101  22.73,5.43 0 top
JP102  17.65,94.33 90 top
JP103  22.73,94.33 90 top
JP104  27.81,94.33 90 top
JP105  32.89,94.33 90 top
JP106  20.19,94.33 90 top
JP107  25.27,94.33 90 top
JP108  30.35,94.33 90 top
JP109  35.43,94.33 90 top
JP110  20.19,81.63 0 top
JP111  20.19,79.09 0 top
JP112  25.27,86.71 0 top
JP113  25.27,84.17 0 top
JP114  25.27,68.93 0 top
JP115  25.27,71.47 0 top
JP116  25.27,74.01 0 top
JP117  25.27,76.55 0 top
JP118  25.27,79.09 0 top
JP119  25.27,81.63 0 top
JP120  32.89,91.79 0 top
JP121  32.89,89.25 0 top
JP122  32.89,66.39 0 top
JP123  48.13,74.01 0 top
JP124  48.13,76.55 0 top
JP125  48.13,94.33 90 top
JP126  50.67,94.33 90 top
LOGO1  11.82,24 0 top
LOGO2  57.43,39.5 270 top
S1  55.75,7.97 270 top
TILDA1  67.93,0 90 top
U$1  22.73,11.78 180 top
U$2  39.87,11.15 90 bottom
U$5  38.34,11.14 90 top

### Tracks (layer width: path | path; a pad name or v marks a point on that pad's centre or on a via)
3V3  (4 unrouted)
5V0  (7 unrouted)
!RESET  (2 unrouted)
A0  (1 unrouted)
A1  (1 unrouted)
A2  (1 unrouted)
A3  (1 unrouted)
A4  (1 unrouted)
A5  (1 unrouted)
AREF  (1 unrouted)
AUX  (1 unrouted)
CANRX  (1 unrouted)
CANTX  (1 unrouted)
D0  (1 unrouted)
D1  (1 unrouted)
D2  (1 unrouted)
D3  (1 unrouted)
D4  (1 unrouted)
D5  (1 unrouted)
D6  (1 unrouted)
D7  (1 unrouted)
D8  (1 unrouted)
D9  (1 unrouted)
D10  (1 unrouted)
D11  (1 unrouted)
D12  (1 unrouted)
D13  (1 unrouted)
DAC0  (1 unrouted)
DAC1  (1 unrouted)
GND
  pour Top: 67.93,100 7.93,100 arc52 3.93,50 arc-52 -0.07,0 59.93,0 arc52 63.93,50 arc-52
  pour Bottom: 67.93,100 7.93,100 arc52 3.93,50 arc-52 -0.07,0 59.93,0 arc52 63.93,50 arc-52
IOREF  (1 unrouted)
ISP_!RESET  (1 unrouted)
MISO  (1 unrouted)
MOSI  (1 unrouted)
N$1  (21 unrouted)
N$2  (21 unrouted)
N$3  (2 unrouted)
N$4  (2 unrouted)
N$5  (2 unrouted)
N$6  (2 unrouted)
N$7  (2 unrouted)
N$8  (2 unrouted)
N$9  (2 unrouted)
N$10  (2 unrouted)
N$11  (2 unrouted)
N$12  (2 unrouted)
N$13  (2 unrouted)
N$14  (2 unrouted)
N$15  (2 unrouted)
N$16  (2 unrouted)
N$17  (2 unrouted)
N$18  (2 unrouted)
N$19  (2 unrouted)
N$20  (2 unrouted)
N$21  (2 unrouted)
N$22  (2 unrouted)
N$23  (2 unrouted)
N$24  (2 unrouted)
N$25  (2 unrouted)
N$26  (2 unrouted)
N$27  (2 unrouted)
N$28  (2 unrouted)
N$29  (2 unrouted)
N$30  (2 unrouted)
N$31  (2 unrouted)
N$32  (2 unrouted)
N$33  (2 unrouted)
N$34  (2 unrouted)
N$35  (2 unrouted)
N$36  (2 unrouted)
N$37  (2 unrouted)
N$38  (2 unrouted)
N$39  (2 unrouted)
N$41  (2 unrouted)
N$43  (2 unrouted)
N$44  (2 unrouted)
N$45  (2 unrouted)
N$46  (2 unrouted)
N$47  (2 unrouted)
N$48  (2 unrouted)
N$49  (2 unrouted)
N$50  (2 unrouted)
N$51  (2 unrouted)
N$52  (2 unrouted)
N$53  (2 unrouted)
N$54  (2 unrouted)
N$55  (2 unrouted)
N$56  (2 unrouted)
N$57  (2 unrouted)
N$58  (2 unrouted)
N$59  (2 unrouted)
N$61  (2 unrouted)
N$63  (2 unrouted)
N$65  (2 unrouted)
N$66  (2 unrouted)
N$67  (2 unrouted)
N$68  (2 unrouted)
N$69  (2 unrouted)
N$70  (2 unrouted)
N$71  (2 unrouted)
N$72  (2 unrouted)
N$73  (2 unrouted)
N$74  (2 unrouted)
N$75  (2 unrouted)
N$76  (2 unrouted)
N$77  (2 unrouted)
N$78  (2 unrouted)
N$79  (2 unrouted)
N$80  (2 unrouted)
N$81  (2 unrouted)
N$82  (2 unrouted)
N$83  (1 unrouted)
N$84  (1 unrouted)
N$85  (2 unrouted)
N$86  (2 unrouted)
N$87  (2 unrouted)
N$88  (2 unrouted)
N$89  (2 unrouted)
N$90  (2 unrouted)
N$91  (1 unrouted)
N$92  (1 unrouted)
N$99  (1 unrouted)
N$100  (1 unrouted)
N$101  (1 unrouted)
N$102  (1 unrouted)
N$103  (1 unrouted)
N$104  (1 unrouted)
N$105  (1 unrouted)
N$106  (1 unrouted)
N$107  (1 unrouted)
N$108  (1 unrouted)
N$109  (1 unrouted)
N$110  (1 unrouted)
N$111  (1 unrouted)
N$112  (1 unrouted)
N$113  (1 unrouted)
N$114  (1 unrouted)
N$115  (1 unrouted)
N$116  (1 unrouted)
N$117  (1 unrouted)
N$118  (1 unrouted)
N$119  (1 unrouted)
N$120  (1 unrouted)
N$121  (1 unrouted)
N$122  (1 unrouted)
N$123  (1 unrouted)
N$124  (1 unrouted)
N$125  (1 unrouted)
N$126  (1 unrouted)
N$127  (1 unrouted)
N$128  (1 unrouted)
N$129  (1 unrouted)
N$130  (1 unrouted)
N$131  (1 unrouted)
N$132  (1 unrouted)
N$133  (1 unrouted)
N$134  (1 unrouted)
N$136  (1 unrouted)
RESERVED  (1 unrouted)
S1
  Top 0.254: JP94.7 47.49,3.52 U$5.1
  Bottom 0.254: U$2.28 46.29,4.16 JP94.7
S2
  Top 0.254: JP95.7 49.4,5.43 47.37,5.43 46.73,4.79 U$5.2
  Bottom 0.254: U$2.27 44.72,7.57 46.86,5.43 49.4,5.43 JP95.7
S3
  Top 0.254: JP94.6 47.49,6.06 U$5.3
  Bottom 0.254: U$2.26 45.34,8.22 46.86,6.7 JP94.6
S5
  Top 0.254: JP94.5 47.49,8.6 U$5.5
  Bottom 0.254: U$2.24 47.85,9.52 JP94.5
S6
  Top 0.254: JP95.5 49.4,10.51 47.37,10.51 46.73,9.87 U$5.6
  Bottom 0.254: U$2.23 46.52,10.17 46.86,10.51 49.4,10.51 JP95.5
S7
  Top 0.254: JP94.4 47.49,11.14 U$5.7
  Bottom 0.254: U$2.22 45.9,10.82 46.86,11.78 JP94.4
S8
  Top 0.254: JP95.4 49.4,13.05 47.37,13.05 46.73,12.41 U$5.8
  Bottom 0.254: U$2.21 45.15,11.47 46.73,13.05 49.4,13.05 JP95.4
S9
  Top 0.254: JP94.3 47.49,13.68 U$5.9
  Bottom 0.254: U$2.20 44.53,12.12 46.73,14.32 JP94.3
S10
  Top 0.254: JP95.3 49.4,15.59 47.37,15.59 46.73,14.95 U$5.10
  Bottom 0.254: U$2.19 44.42,12.77 47.24,15.59 49.4,15.59 JP95.3
S11
  Top 0.254: JP94.2 47.49,16.22 U$5.11
  Bottom 0.254: U$2.18 44.31,13.42 47.24,16.35 47.62,16.35 JP94.2
S12
  Top 0.254: JP95.2 49.4,18.13 47.37,18.13 46.73,17.49 U$5.12
  Bottom 0.254: U$2.17 44.32,14.07 45.46,15.21 45.46,16.74 46.86,18.13 49.4,18.13 JP95.2
S13
  Top 0.254: JP94.1 47.49,18.76 U$5.13
  Bottom 0.254: U$2.16 44.34,14.72 44.95,15.34 44.95,17.5 46.86,19.4 JP94.1
S14
  Top 0.254: JP95.1 49.4,20.67 47.37,20.67 46.73,20.03 U$5.14
  Bottom 0.254: JP95.1 49.4,20.67 47.37,20.67 43.56,16.86 43.56,15.47 43.49,15.4 | 43.49,15.4 43.43,15.34 | U$2.15 43.49,15.4
S15
  Top 0.254: JP96.7 30.35,20.67 32.38,20.67 33.02,20.03 U$5.15
  Bottom 0.254: JP96.7 30.35,20.67 32.38,20.67 36.22,16.84 U$2.14
S16
  Top 0.254: JP97.7 32.26,18.76 U$5.16
  Bottom 0.254: U$2.13 36.2,14.7 35.43,14.7 34.79,15.34 34.79,17.37 32.76,19.4 JP97.7
S17
  Top 0.254: JP96.6 30.35,18.13 32.38,18.13 33.02,17.49 U$5.17
  Bottom 0.254: U$2.12 35.43,14.07 34.16,15.34 34.16,16.74 32.89,18.13 30.35,18.13 JP96.6
S18
  Top 0.254: JP97.6 32.26,16.22 U$5.18
  Bottom 0.254: U$2.11 35.44,13.42 32,16.86 JP97.6
S19
  Top 0.254: JP96.5 30.35,15.59 32.13,15.59 32.77,14.95 U$5.19
  Bottom 0.254: U$2.10 35.33,12.77 32.51,15.59 30.35,15.59 JP96.5
S20
  Top 0.254: JP97.5 32.26,13.68 U$5.20
  Bottom 0.254: U$2.9 35.22,12.12 33.02,14.32 JP97.5
S21
  Top 0.254: JP96.4 30.35,13.05 32.38,13.05 33.02,12.41 U$5.21
  Bottom 0.254: U$2.8 34.47,11.47 32.89,13.05 30.35,13.05 JP96.4
S22
  Top 0.254: JP97.4 32.26,11.14 U$5.22
  Bottom 0.254: U$2.7 33.85,10.82 32.89,11.78 JP97.4
S23
  Top 0.254: JP96.3 30.35,10.51 32.38,10.51 33.02,9.87 U$5.23
  Bottom 0.254: U$2.6 33.23,10.17 32.89,10.51 30.35,10.51 JP96.3
S24
  Top 0.254: JP97.3 32.26,8.6 U$5.24
  Bottom 0.254: U$2.5 31.9,9.52 JP97.3
S25
  Top 0.254: JP96.2 30.35,7.97 32.38,7.97 33.02,7.33 U$5.25
  Bottom 0.254: U$2.4 33.79,8.87 32.89,7.97 30.35,7.97 JP96.2
S26
  Top 0.254: JP97.2 32.26,6.06 U$5.26
  Bottom 0.254: U$2.3 34.54,8.22 33.02,6.7 JP97.2
S27
  Top 0.254: JP96.1 30.35,5.43 32.38,5.43 33.02,4.79 U$5.27
  Bottom 0.254: U$2.2 35.03,7.57 32.89,5.43 30.35,5.43 JP96.1
S28
  Top 0.254: JP97.1 32.26,3.52 U$5.28
  Bottom 0.254: U$2.1 33.46,4.16 JP97.1
S32
  Top 0.254: JP95.6 49.4,7.97 47.37,7.97 46.73,7.33 U$5.4
  Bottom 0.254: U$2.25 45.96,8.87 46.86,7.97 49.4,7.97 JP95.6
SCK  (1 unrouted)
SCL  (1 unrouted)
SDA  (1 unrouted)
VIN  (1 unrouted)
(copper drawn outside any net)
  shapes: Bottom area x28

### Text on the board
tPlace: ProtoSheild | v0.1 | TiLDA | badge.emfcamp.org
Reference: -0.06, 0.35